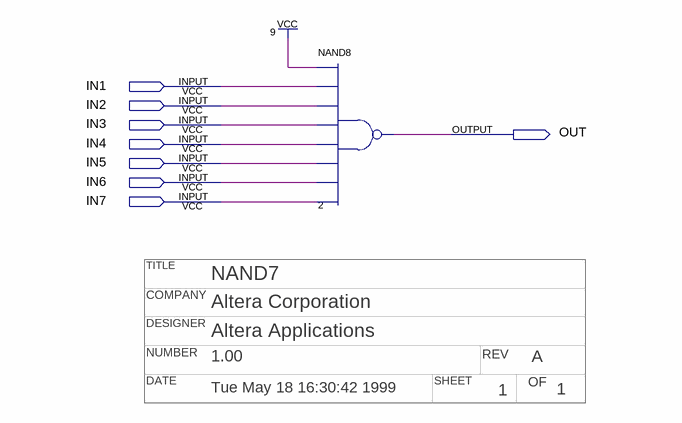
[diagram p0: schematic sheet]
// Quartus schematic nand7.bdf as structural Verilog: 1 symbols, 8 pins
// Title block: TITLE: NAND7; COMPANY: Altera Corporation; DESIGNER: Altera Applications; NUMBER: 1.00; REV: A; DATE: Tue May 18 16:30:42 1999; SHEET: 1; OF: 1
module nand7 (
  input  IN1,
  input  IN2,
  input  IN3,
  input  IN4,
  input  IN5,
  input  IN6,
  input  IN7,
  output OUT
);

  nand u_2 (OUT, 1'b1, IN1, IN2, IN3, IN4, IN5, IN6, IN7);
endmodule
